# EAGLE design cameraModule (EAGLE 5.12)
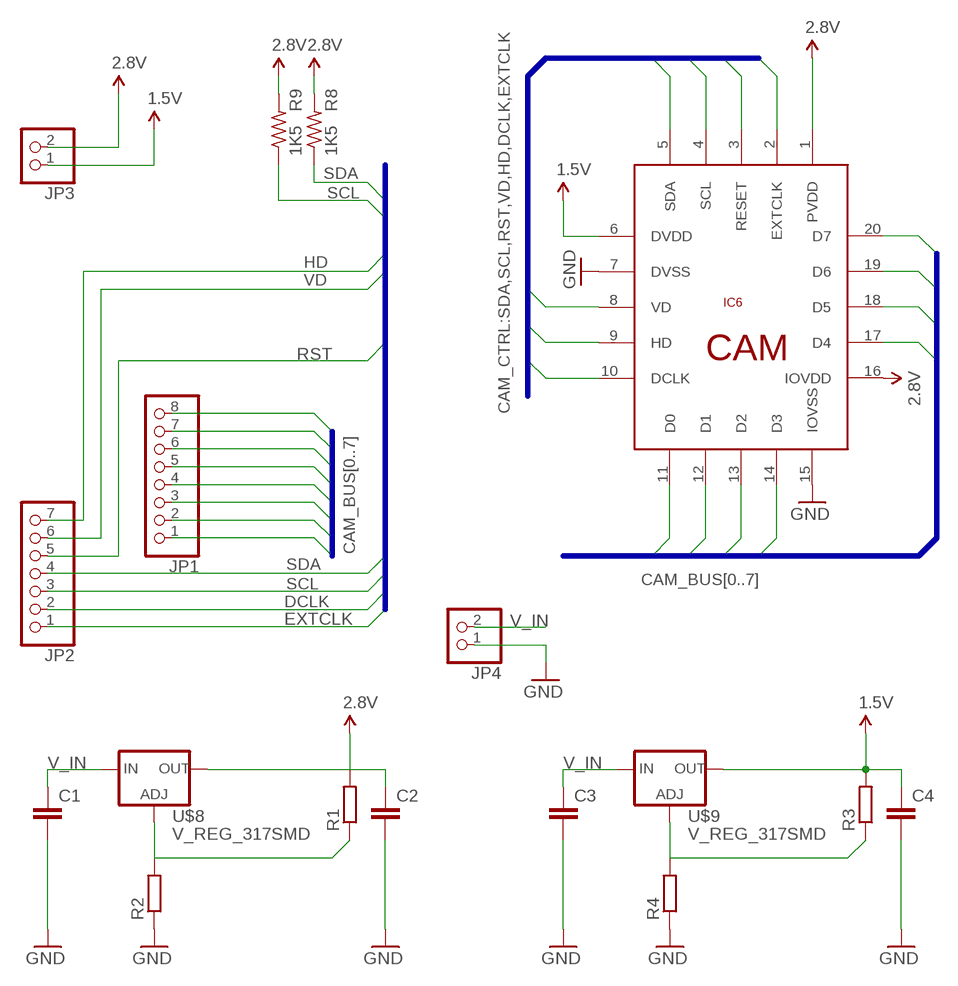
[diagram p0: schematic, sheet 1]

## Parts
C1  C-EUC0603  [C0603]
C2  C-EUC0603  [C0603]
C3  C-EUC0603  [C0603]
C4  C-EUC0603  [C0603]
IC6  TCM8230MDA  [TCM8230MD]
JP1  PINHD-1X8  [1X08]
JP2  PINHD-1X7  [1X07]
JP3  PINHD-1X2  [1X02]
JP4  PINHD-1X2  [1X02]
R1  R-EU_R0603  [R0603]
R2  R-EU_R0603  [R0603]
R3  R-EU_R0603  [R0603]
R4  R-EU_R0603  [R0603]
R8  1K5  R-US_R0805  [R0805]
R9  1K5  R-US_R0805  [R0805]
U$8  V_REG_317SMD  [SOT223]
U$9  V_REG_317SMD  [SOT223]

## Nets
1.8V: C4.1 IC6.6(DVDD) JP3.1 R3.2 U$9.2(OUT) ; supply symbol labelled 1.5V
2.8V: C2.1 IC6.1(PVDD) IC6.16(IOVDD) JP3.2 R1.2 R8.2 R9.2 U$8.2(OUT)
CAM_BUS0: IC6.11(D0) JP1.8
CAM_BUS1: IC6.12(D1) JP1.7
CAM_BUS2: IC6.13(D2) JP1.6
CAM_BUS3: IC6.14(D3) JP1.5
CAM_BUS4: IC6.17(D4) JP1.4
CAM_BUS5: IC6.18(D5) JP1.3
CAM_BUS6: IC6.19(D6) JP1.2
CAM_BUS7: IC6.20(D7) JP1.1
DCLK: IC6.10(DCLK) JP2.2
EXTCLK: IC6.2(EXTCLK) JP2.1
GND: C1.2 C2.2 C3.2 C4.2 IC6.7(DVSS) IC6.15(IOVSS) JP4.1 R2.1 R4.1
HD: IC6.9(HD) JP2.7
N$6: R1.1 R2.2 U$8.1(ADJ)
N$7: R3.1 R4.2 U$9.1(ADJ)
RST: IC6.3(RESET) JP2.5
SCL: IC6.4(SCL) JP2.3 R9.1
SDA: IC6.5(SDA) JP2.4 R8.1
V_IN: C1.1 C3.1 JP4.2 U$8.3(IN) U$9.3(IN)
VD: IC6.8(VD) JP2.6

## Buses
CAM_BUS[0..7]
CAM_CTRL:SDA,SCL,RST,VD,HD,DCLK,EXTCLK

## Notes on the sheet
- CAM

## Library data of the parts
C1-C4 = rcl:C-EU: CAPACITOR, European symbol
IC6 = ika2:TCM8230MD
JP1 = pinhead:PINHD-1X8: PIN HEADER
JP2 = pinhead:PINHD-1X7: PIN HEADER
JP3 JP4 = pinhead:PINHD-1X2: PIN HEADER
R1-R4 = rcl:R-EU_: RESISTOR, European symbol
R8 R9 = rcl:R-US_: RESISTOR, American symbol
U$8 U$9 = SparkFun:V_REG_317: Voltage Regulator Standard LM317 adjustable voltage regulator. AOI (Adjust Output Input). Google 'LM317 Calculator' for easy to use app to get the two resistor values needed. 240/720 for 5V output. 240/390 for 3.3V output. Spark Fun Electronics SKU : COM-00527

## Board
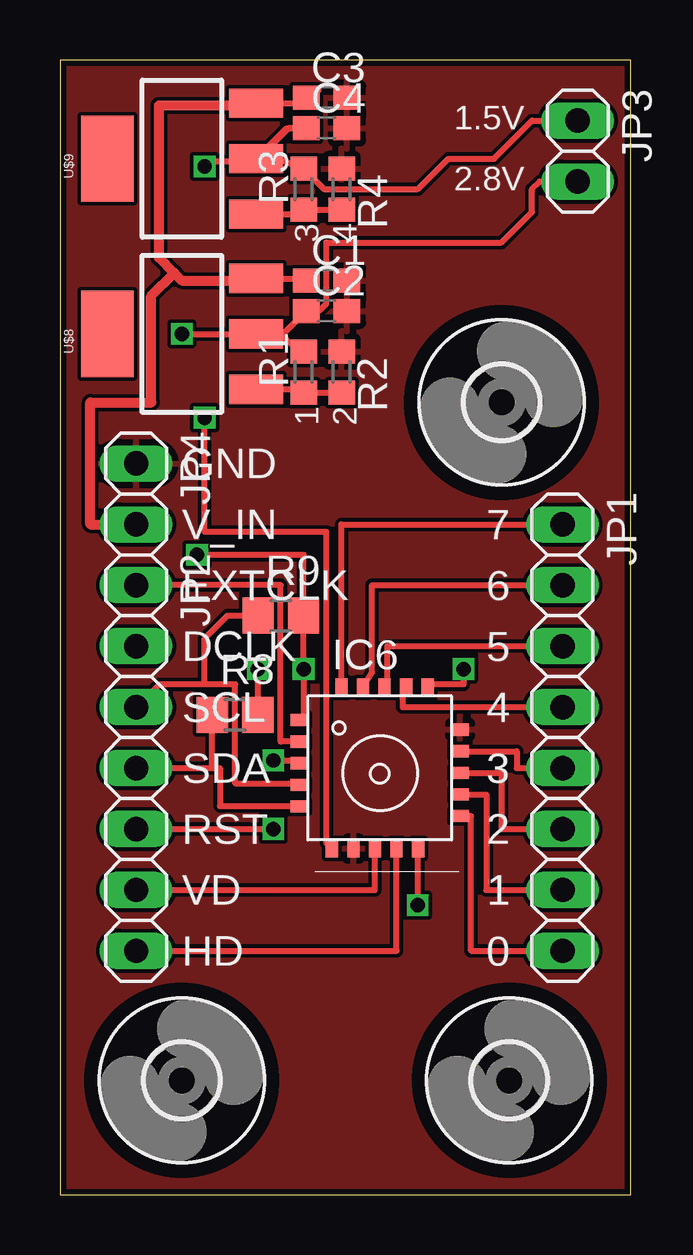
[diagram p1: board, top side]
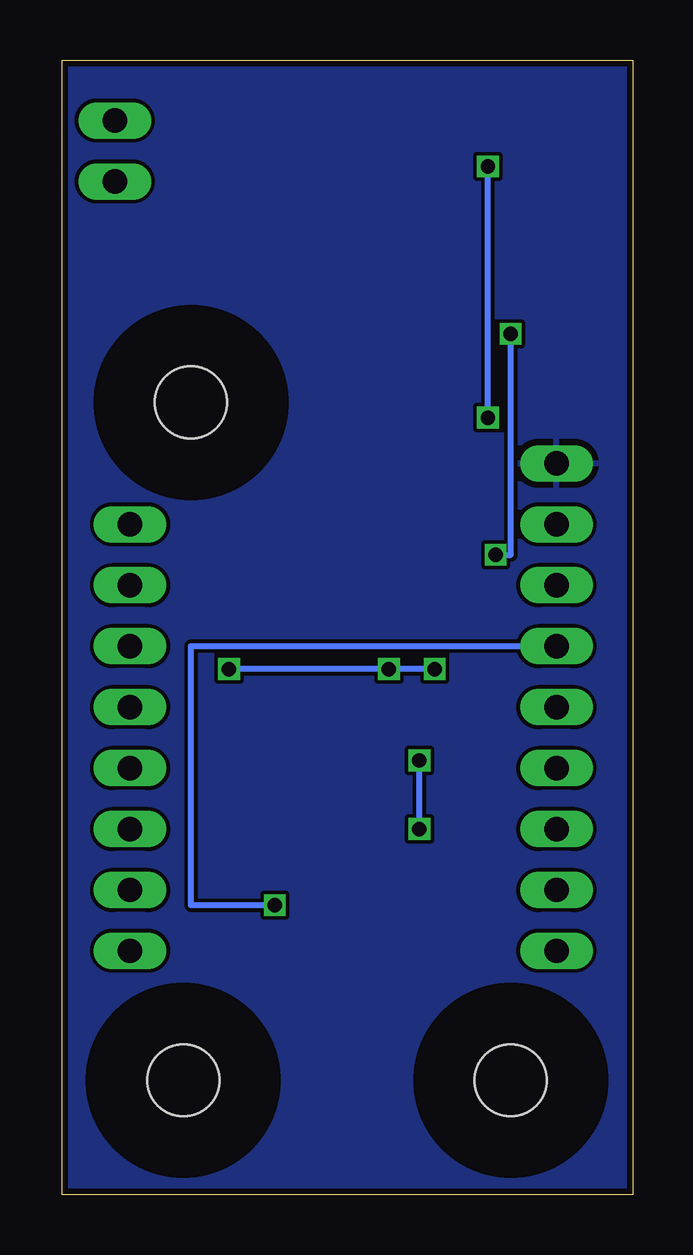
[diagram p2: board, bottom side, seen from below]

Size 23.79 x 47.3 mm. Coordinates in mm from the lower left corner, seen from the top.
Outline: 0,0 23.79,0 23.79,47.3 0,47.3 0,0
Copper layers (1*16): Top 0.035mm / dielectric 1.5mm / Bottom 0.035mm
Design rules "Fusion_eagle_rule_v1.1": minimum track width 6mil, minimum drill 12mil, track to track 6mil, track to pad 6mil, pad to pad 6mil, via to via 6mil, smd to smd 0mil, copper to edge 10mil, drill to drill 10mil, minimum pad ring 10mil, minimum via ring 6mil, stop-mask expansion 2mil, vias tented up to drill 100mil, thermal gap 10mil

### Footprints (pad centres in the part's own frame; a part is rotated, then mirrored left to right if it is on the bottom)
C0603 = smd 1.1 x 1: 1 -0.85,0; 2 0.85,0
TCM8230MD = smd 0.75 x 0.508: 1 -3.35,2; 2 -3.35,1.1; 3 -3.35,0.2; 4 -3.35,-0.7; 5 -3.35,-1.6; 11 3.35,-2; 12 3.35,-1.1; 13 3.35,-0.2; 14 3.35,0.7; 15 3.35,1.6 | smd 0.508 x 0.75: 6 -2,-3.35; 7 -1.1,-3.35; 8 -0.2,-3.35; 9 0.7,-3.35; 10 1.6,-3.35; 16 2,3.35; 17 1.1,3.35; 18 0.2,3.35; 19 -0.7,3.35; 20 -1.6,3.35
1X08 = drill 1.016 long: 1 -8.89,0; 2 -6.35,0; 3 -3.81,0; 4 -1.27,0; 5 1.27,0; 6 3.81,0; 7 6.35,0; 8 8.89,0
1X07 = drill 1.016 long: 1 -7.62,0; 2 -5.08,0; 3 -2.54,0; 4 0,0; 5 2.54,0; 6 5.08,0; 7 7.62,0
1X02 = drill 1.016 long: 1 -1.27,0; 2 1.27,0
R0603 = smd 1 x 1.1: 1 -0.85,0; 2 0.85,0
R0805 = smd 1.3 x 1.5: 1 -0.95,0; 2 0.95,0
3,0 = hole 3: 0,0
SOT223 = smd 1.219 x 2.235: 1 -2.311,-3.099; 2 0,-3.099; 3 2.311,-3.099 | smd 3.6 x 2.2: 4 0,3.099

### Placement (x,y rotation side)
C1  11.11,38.1 0 top
C2  11.11,36.83 0 top
C3  11.11,45.72 0 top
C4  11.11,44.45 0 top
IC6  13.34,17.78 0 top
JP1  20.95,19.05 270 top
JP2  3.17,17.78 270 top
JP3  21.59,43.5 270 top
JP4  3.17,29.21 270 top
R1  10.16,34.29 90 top
R2  11.75,34.29 270 top
R3  10.16,41.91 90 top
R4  11.75,41.91 270 top
R8  7.3,20 0 top
R9  9.21,24.13 0 top
U$4  [3,0]  5.08,4.76 0 top
U$5  [3,0]  18.41,33.02 0 top
U$7  [3,0]  18.73,4.76 0 top
U$8  5.08,35.88 90 top
U$9  5.08,43.18 90 top

### Tracks (layer width: path | path; a pad name or v marks a point on that pad's centre or on a via)
1.8V  (via drill 0.6)
  Top 0.254: IC6.6 11.11,14.65 11.11,27.62 6.03,27.62 v6.03,32.38 | U$9.2 9.11,43.18 R3.2 11.01,41.91 14.92,41.91 16.19,43.18 18.1,43.18 19.68,44.77 JP3.1 | U$9.2 9.45,44.45 C4.1 9.53,44.45 8.89,43.81 | v6.03,42.86 6.45,43.08 8.08,43.08 U$9.2
  Bottom 0.254: v6.03,32.38 v6.03,42.86
2.8V  (via drill 0.6)
  Top 0.254: IC6.1 10.16,19.78 v10.16,21.91 10.16,23.5 10.48,23.81 R9.2 10.16,26.67 v5.71,26.67 | v16.83,21.91 16.83,21.27 15.34,21.27 IC6.16 | R8.2 v8.26,21.91 | 9.21,35.88 U$8.2 v5.08,35.88 | 9.21,35.88 9.31,35.88 C2.1 10.79,36.83 11.11,37.15 11.11,39.69 18.41,39.69 19.68,40.96 19.68,41.91 20,42.23 JP3.2 | R1.2 9.95,35.14 9.21,35.88
  Bottom 0.254: v16.83,21.91 v10.16,21.91 v8.26,21.91 | v5.71,26.67 5.08,26.67 v5.08,35.88
CAM_BUS0
  Top 0.254: IC6.11 17.14,15.78 17.14,10.16 JP1.8
CAM_BUS1
  Top 0.254: IC6.12 17.78,16.68 17.78,12.7 JP1.7
CAM_BUS2
  Top 0.254: IC6.13 18.41,17.58 18.41,15.24 JP1.6
CAM_BUS3
  Top 0.254: IC6.14 19.05,18.48 19.05,17.78 JP1.5
CAM_BUS4
  Top 0.254: IC6.17 14.29,21.13 14.29,20.32 JP1.4
CAM_BUS5
  Top 0.254: IC6.18 13.65,21.13 13.65,22.86 JP1.3
CAM_BUS6
  Top 0.254: IC6.19 13.02,21.77 13.02,25.4 JP1.2
CAM_BUS7
  Top 0.254: JP1.1 11.73,27.94 IC6.20
DCLK  (via drill 0.6)
  Top 0.254: v14.92,12.06 14.94,12.06 IC6.10
  Bottom 0.254: JP2.2 18.41,22.86 18.41,12.06 v14.92,12.06
EXTCLK
  Top 0.254: IC6.2 9.21,18.88 9.21,25.4 JP2.1
GND
  pour Top: 0,0 23.81,0 23.81,47.31 0,47.31
  pour Bottom: 0,0 23.81,0 23.81,47.31 0,47.31
HD
  Top 0.254: JP2.7 14.04,10.16 IC6.9
N$6
  Top 0.254: U$8.1 10.03,33.57 R1.1 R2.2
N$7
  Top 0.254: U$9.1 10.29,40.87 R3.1 R4.2
RST  (via drill 0.6)
  Top 0.254: JP2.5 v8.89,15.24 | v8.89,18.1 9.98,18.1 IC6.3
  Bottom 0.254: v8.89,15.24 v8.89,18.1
SCL
  Top 0.254: 6.03,21.27 7.3,21.27 7.3,17.14 9.98,17.14 IC6.4 | 6.03,21.27 4.13,21.27 JP2.3 | R9.1 6.99,24.13 6.03,23.18 6.03,21.27
SDA
  Top 0.254: JP2.4 6.35,17.78 | 6.35,17.78 6.67,17.78 6.67,16.19 9.98,16.19 IC6.5 | R8.1 6.35,17.78
V_IN
  Top 0.254: 10.35,45.49 U$9.3 8.09,45.4 | 10.35,45.49 C3.1 | 7.12,38.1 7.21,38.19 U$8.3 10.17,38.19 C1.1 10.16,38.2 | 10.35,45.49 10.35,45.59 10.79,46.04
  Top 0.406: 8.09,45.4 4.13,45.4 4.13,39.05 4.76,38.42 | 4.76,38.42 5.08,38.1 7.12,38.1 | JP4.2 1.27,27.94 1.27,33.02 3.81,33.02 3.81,37.47 4.76,38.42
VD
  Top 0.254: JP2.6 13.13,12.7 IC6.8

### Text on the board
_tsilk: 1.5V | 2.8V | 3 | 4 | 1 | 2 | GND | V_IN | 7 | EXTCLK | 6 | DCLK | 5 | SCL | 4 | SDA | 3 | RST | 2 | VD | 1 | HD | 0